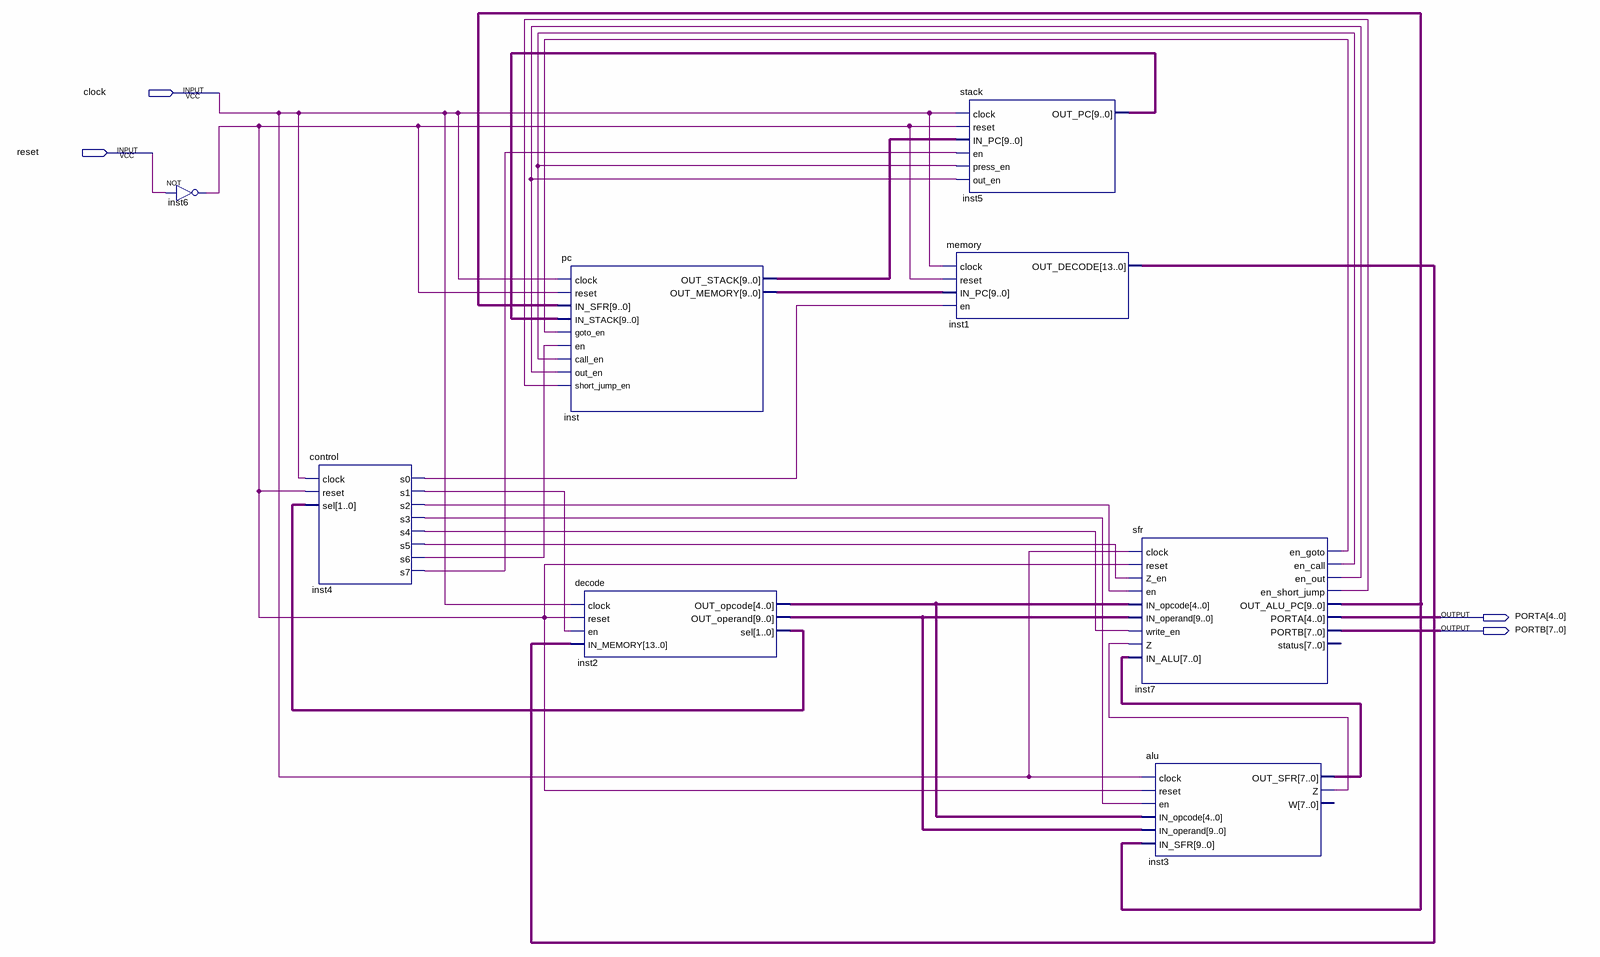
[diagram p0: schematic sheet]
// Quartus schematic top.bdf as structural Verilog: 8 symbols, 4 pins
module top (
  input  clock,
  input  reset,
  output [4:0] PORTA,
  output [7:0] PORTB
);

  wire inst3_z, inst4_s0, inst4_s1, inst4_s2, inst4_s3, inst4_s4, inst4_s5, inst4_s6, inst4_s7, inst6_out,
       inst7_en_call, inst7_en_goto, inst7_en_out, inst7_en_short_jump;
  wire [1:0] inst2_sel;
  wire [4:0] inst2_out_opcode;
  wire [7:0] inst3_out_sfr;
  wire [9:0] inst2_out_operand, inst5_out_pc, inst7_out_alu_pc, inst_out_memory, inst_out_stack;
  wire [13:0] inst1_out_decode;

  not inst6 (inst6_out, reset);
  control inst4 (
    .clock(clock), .reset(inst6_out), .sel(inst2_sel), .s0(inst4_s0), .s1(inst4_s1), .s2(inst4_s2),
    .s3(inst4_s3), .s4(inst4_s4), .s5(inst4_s5), .s6(inst4_s6), .s7(inst4_s7));
  pc inst (
    .clock(clock), .reset(inst6_out), .IN_SFR(inst7_out_alu_pc), .IN_STACK(inst5_out_pc),
    .goto_en(inst7_en_goto), .en(inst4_s6), .call_en(inst7_en_call), .out_en(inst7_en_out),
    .short_jump_en(inst7_en_short_jump), .OUT_STACK(inst_out_stack), .OUT_MEMORY(inst_out_memory));
  decode inst2 (
    .clock(clock), .reset(inst6_out), .en(inst4_s1), .IN_MEMORY(inst1_out_decode),
    .OUT_opcode(inst2_out_opcode), .OUT_operand(inst2_out_operand), .sel(inst2_sel));
  stack inst5 (
    .clock(clock), .reset(inst6_out), .IN_PC(inst_out_stack), .en(inst4_s7), .press_en(inst7_en_call),
    .out_en(inst7_en_out), .OUT_PC(inst5_out_pc));
  memory inst1 (
    .clock(clock), .reset(inst6_out), .IN_PC(inst_out_memory), .en(inst4_s0), .OUT_DECODE(inst1_out_decode));
  sfr inst7 (
    .clock(clock), .reset(inst6_out), .Z_en(inst4_s5), .en(inst4_s2), .IN_opcode(inst2_out_opcode),
    .IN_operand(inst2_out_operand), .write_en(inst4_s4), .Z(inst3_z), .IN_ALU(inst3_out_sfr),
    .en_goto(inst7_en_goto), .en_call(inst7_en_call), .en_out(inst7_en_out),
    .en_short_jump(inst7_en_short_jump), .OUT_ALU_PC(inst7_out_alu_pc), .PORTA(PORTA), .PORTB(PORTB));  // open: status
  alu inst3 (
    .clock(clock), .reset(inst6_out), .en(inst4_s3), .IN_opcode(inst2_out_opcode),
    .IN_operand(inst2_out_operand), .IN_SFR(inst7_out_alu_pc), .OUT_SFR(inst3_out_sfr), .Z(inst3_z));  // open: W
endmodule
